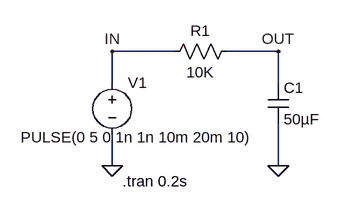
[diagram p0: schematic Charging and Discharging in RC.asc]
Charging and Discharging in RC.asc, the LTspice schematic file:
Version 4
SHEET 1 880 680
WIRE 352 192 256 192
WIRE 512 192 432 192
WIRE 256 240 256 192
WIRE 512 240 512 192
WIRE 256 368 256 320
WIRE 512 368 512 304
FLAG 256 368 0
FLAG 512 368 0
FLAG 512 192 OUT
FLAG 256 192 IN
SYMBOL cap 496 240 R0
SYMATTR InstName C1
SYMATTR Value 50µF
SYMBOL voltage 256 224 R0
WINDOW 3 -141 100 Left 2
SYMATTR Value PULSE(0 5 0 1n 1n 10m 20m 10)
SYMATTR InstName V1
SYMBOL res 448 176 R90
WINDOW 0 0 56 VBottom 2
WINDOW 3 32 56 VTop 2
SYMATTR InstName R1
SYMATTR Value 10K
TEXT 272 392 Left 2 !.tran 0.2s

The netlist it stands for:
* Charging and Discharging in RC.asc
C1 OUT 0 50µF
V1 IN 0 PULSE(0 5 0 1n 1n 10m 20m 10)
R1 OUT IN 10K
.tran 0.2s
.backanno
.end